# Altium schematic sheet ObjPoint01-00.SchDoc
size A4
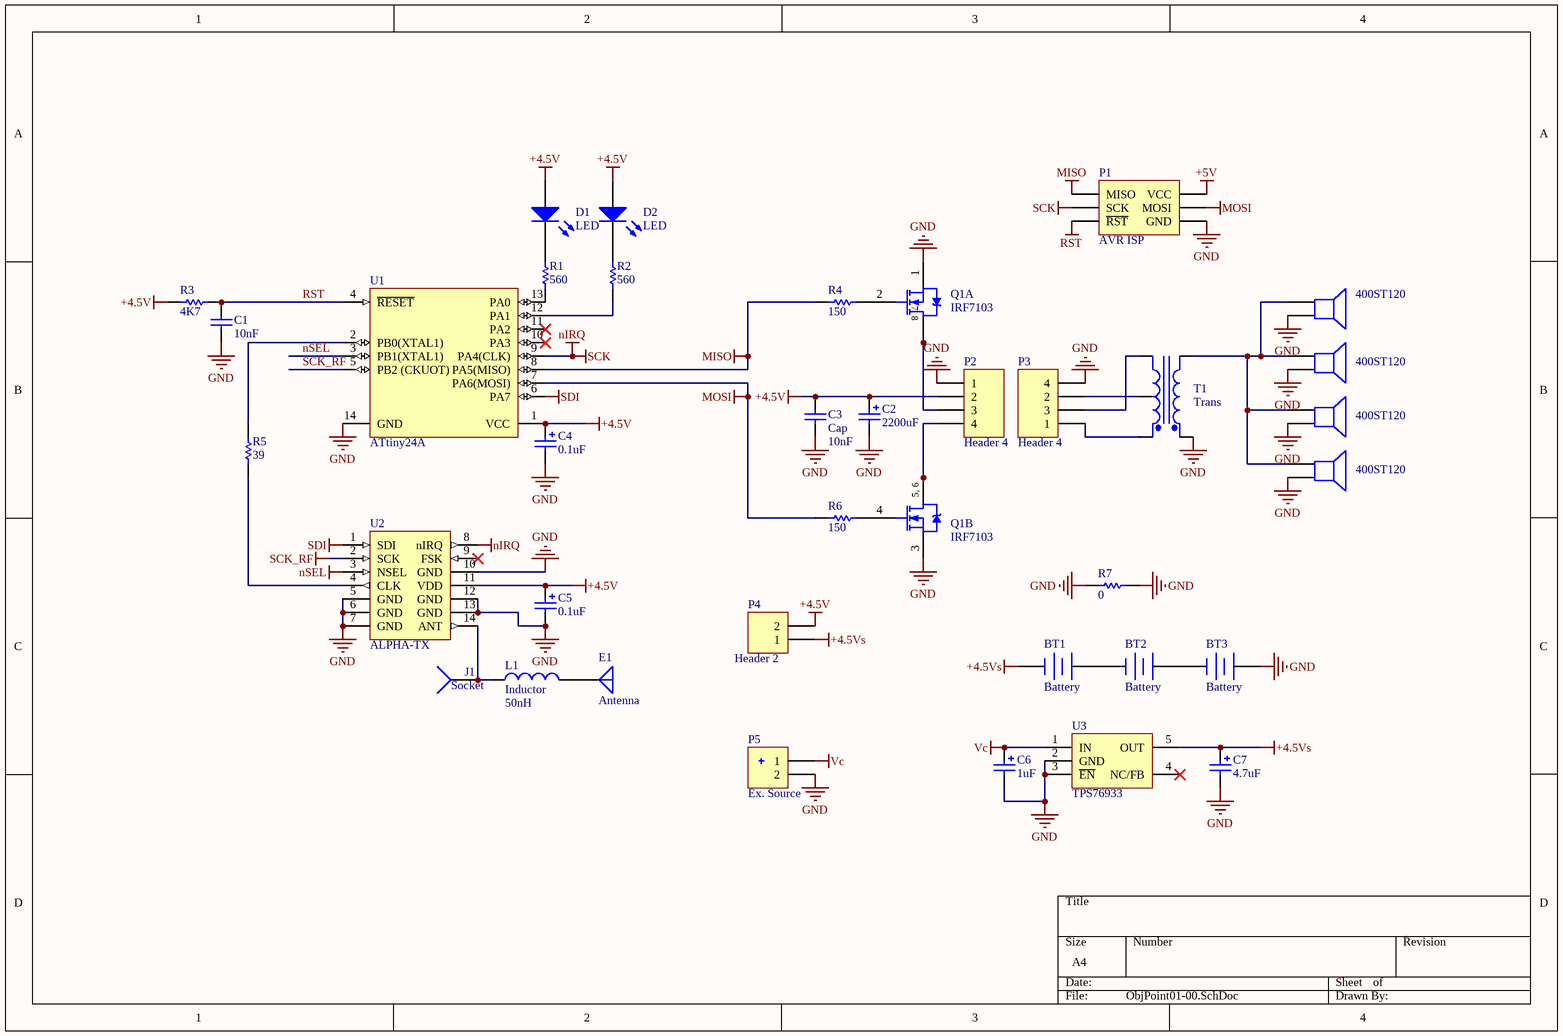
[diagram p0: ObjPoint01-00.SchDoc]

## Parts
BT1  Battery  [AAA Battery Holder]
BT2  Battery  [AAA Battery Holder]
BT3  Battery  [AAA Battery Holder]
C1  value 10nF  [1206]  (hidden comment: SMD Capacitor)
C2  value 2200uF  [Capasitor 13.3mm diametras 20.3 aukstis tarp koju 5mm kojos storis 0.6mm]  (hidden comment: Cap)
C3  Cap  value 10nF  [0805]
C4  value 0.1uF  [A]  (hidden comment: Tantalum SMD Capacitors)
C5  value 0.1uF  [A]  (hidden comment: Tantalum SMD Capacitors)
C6  value 1uF  [A]  (hidden comment: Tantalum SMD Capacitors)
C7  value 4.7uF  [A]  (hidden comment: Tantalum SMD Capacitors)
D1  LED  [LED 3mm DIP]
D2  LED  [LED 3mm DIP]
E1  Antenna
J1  Socket  [PIN1]
L1  Inductor  value 50nH  [INDC2012L]
LS1  400ST120  [400ST 120]
LS2  400ST120  [400ST 120]
LS3  400ST120  [400ST 120]
LS4  400ST120  [400ST 120]
P1  AVR ISP  [HDR2X3]
P2  Header 4  [HDR1X4]
P3  Header 4  [HDR1X4]
P4  Header 2  [HDR1X2]
P5  Ex. Source  [HDR1X2]
Q1  IRF7103  [SO-8_N]  (parts A,B of 2)
R1  value 560  [0805]  (hidden comment: SMD Resistor)
R2  value 560  [0805]  (hidden comment: SMD Resistor)
R3  value 4K7  [0805]  (hidden comment: SMD Resistor)
R4  value 150  [0805]  (hidden comment: SMD Resistor)
R5  value 39  [0805]  (hidden comment: SMD Resistor)
R6  value 150  [1206]  (hidden comment: SMD Resistor)
R7  value 0  [1206]  (hidden comment: SMD Resistor)
T1  Trans  [TRF_5]
U1  ATtiny24A  [SOIC14T_L]
U2  ALPHA-TX  [ALPHA-TX(RFM02) [SMD]]
U3  TPS76933  [SOT23-5AM]

## Nets
+4.5V: C2.2 C3.2 C4.1 C5.1 D1.1(A) D2.1(A) P2.2 P4.2 R3.1 U1.1(VCC) U2.11(VDD)
+4.5Vs: BT1.2(-) C7.1 P4.1 U3.5(OUT)
+5V: P1.2(VCC)
GND: BT3.1(+) C1.1 C2.1 C3.1 C4.2 C5.2 C6.2 C7.2 LS1.2 LS2.2 LS3.2 LS4.2 P1.6(GND) P2.1 P3.4 P5.2 Q1.1(S) Q1.3(S) R7.1 R7.2 T1.1(Pri+) U1.14(GND) U2.5(GND) U2.6(GND) U2.7(GND) U2.10(GND) U2.12(GND) U2.13(GND) U3.2(GND) U3.3(~{EN})
MISO: P1.1(MISO) R4.1 U1.8(PA5(MISO))
MOSI: P1.4(MOSI) R6.1 U1.7(PA6(MOSI))
nIRQ: P1.3(SCK) U1.9(PA4(CLK)) U2.8(nIRQ)  [also labelled SCK]
nSEL: U1.3(PB1(XTAL1)) U2.3(NSEL)
RST: C1.2 P1.5(~{RST}) R3.2 U1.4(~{RESET})
SCK_RF: U1.5(PB2_(CKUOT)) U2.2(SCK)
SDI: U1.6(PA7) U2.1(SDI)
Vc: C6.1 P5.1 U3.1(IN)
NetBT1_1: BT1.1(+) BT2.2(-)
NetBT2_1: BT2.1(+) BT3.2(-)
NetD1_2: D1.2(K) R1.1
NetD2_2: D2.2(K) R2.2
NetE1_1: E1.1(A) L1.2
NetJ1_1: J1.1 L1.1 U2.14(ANT)
NetLS1_1: LS1.1 LS2.1 LS3.1 LS4.1 T1.2(Pri-)
NetP2_3: P2.3 Q1.7(D) Q1.8(D)
NetP2_4: P2.4 Q1.5(D) Q1.6(D)
NetP3_1: P3.1 T1.5(Sec-)
NetP3_2: P3.2 T1.3(Sec+)
NetP3_3: P3.3 T1.4(SecCT)
NetQ1_2: Q1.2(G) R4.2
NetQ1_4: Q1.4(G) R6.2
NetR1_2: R1.2 U1.13(PA0)
NetR2_1: R2.1 U1.12(PA1)
NetR5_1: R5.1 U2.4(CLK)
NetR5_2: R5.2 U1.2(PB0(XTAL1))

Not connected (* = marked no-connect by the designer): U1 10(PA3)* 11(PA2)*; U2 9(FSK)*; U3 4(NC/FB)*

## Notes on the sheet
- (in symbol IRF7103, part A) 7, 8
- (in symbol IRF7103, part B) 5, 6

## Library data of the parts
BT1-BT3 = Battery: Multicell Battery
C1 = SMD Capacitor: Capacitor (Semiconductor SIM Model); Published: 8-Jun-2000; LatestRevisionDate: 29-May-2009; LatestRevisionNote: IPC-7351 Footprint Added.; PackageReference: C1206; Publisher: Altium Limited; PackageDescription: Chip Capacitor
C2 C4-C7 = Tantalum SMD Capacitors: Capacitor (Semiconductor SIM Model); Published: 8-Jun-2000; LatestRevisionDate: 29-May-2009; LatestRevisionNote: IPC-7351 Footprint Added.; PackageReference: C1206; Publisher: Altium Limited; PackageDescription: Chip Capacitor
C3 = Cap: Capacitor; Published: 8-Jun-2000; LatestRevisionDate: 17-Jul-2002; LatestRevisionNote: Re-released for DXP Platform.; PackageReference: RAD-0.3; Publisher: Altium Limited
D1 D2 = LED0: Typical INFRARED GaAs LED; Published: 8-Jun-2000; LatestRevisionDate: 08-Jul-2005; LatestRevisionNote: Mech Layer 1 removed.; PackageReference: LED-0; Publisher: Altium Limited
E1 = Antenna: Generic Antenna; Published: 24-Mar-1999; LatestRevisionDate: 17-Jul-2002; LatestRevisionNote: Re-released for DXP Platform.; PackageReference: PIN1; Publisher: Altium Limited
L1 = Inductor: Code_IEC: 1005; Published: 8-Jun-2000; LatestRevisionDate: 29-May-2009; LatestRevisionNote: IPC-7351 Footprint Added.; PackageReference: 0402-A; Publisher: Altium Limited; PackageDescription: Chip Inductor; Code_JEITA: 0402
LS1-LS4 = Speaker: Loudspeaker; Published: 24-Mar-1999; LatestRevisionDate: 17-Jul-2002; LatestRevisionNote: Re-released for DXP Platform.; PackageReference: PIN2; Publisher: Altium Limited
P1 = AVR ISP: Header, 6-Pin; LatestRevisionDate: 17-Jul-2002; LatestRevisionNote: Re-released for DXP Platform.; Publisher: Altium Limited
P2 P3 = Header 4: Header, 4-Pin; LatestRevisionDate: 17-Jul-2002; LatestRevisionNote: Re-released for DXP Platform.; Publisher: Altium Limited
P4 = Header 2: Header, 2-Pin; LatestRevisionDate: 17-Jul-2002; LatestRevisionNote: Re-released for DXP Platform.; Publisher: Altium Limited
P5 = Maitinimas: Header, 2-Pin; LatestRevisionDate: 17-Jul-2002; LatestRevisionNote: Re-released for DXP Platform.; Publisher: Altium Limited
Q1 = IRF7103: HEXFET Power MOSFET; Published: 8-Jun-2000; LatestRevisionDate: 13-Apr-2006; LatestRevisionNote: IPC-7351 Footprint Added.; DatasheetVersion: Aug-1997; PackageVersion: Feb-2001; PackageReference: SO-8; Publisher: Altium Limited; PackageDescription: 8-Pin Plastic Small Outline Integrated Circuit 1.27 mm Pitch; Code_JEDEC: MS-012-AA; Code_IPC: SOIC127P600-8; ComponentLink1Description: Manufacturer Link; ComponentLink1URL: http://www.irf.com/; ComponentLink2Description: Datasheet; ComponentLink2URL: http://www.irf.com/product-info/datasheets/data/irf7103.pdf
R1-R7 = SMD Resistor: Semiconductor Resistor; Published: 8-Jun-2000; LatestRevisionDate: 17-Jul-2002; LatestRevisionNote: Re-released for DXP Platform.; PackageReference: AXIAL-0.5; Publisher: Altium Limited
T1 = Trans CT: Center-Tapped Transformer (Coupled Inductor Model); Published: 8-Jun-2000; LatestRevisionDate: 17-Jul-2002; LatestRevisionNote: Re-released for DXP Platform.; PackageReference: TRF_5; Publisher: Altium Limited
U1 = ATtiny261A
U2 = ALPHA-TX: FM Transmitter Module
U3 = TPS769xx: ULTRALOW-POWER 100-mA LOW-DROPOUT LINEAR REGULATORS
J1 = Socket: LatestRevisionDate: 17-Jul-2002; LatestRevisionNote: Re-released for DXP Platform.; Publisher: Altium Limited